# Altium schematic sheet Microphone1.SchDoc: Microphone
size Letter; Author: Ali Saffari; Organization: University of Washinton; Address1: Sensor Systems Lab; Revision: 2; SheetNumber: 1; SheetTotal: 1
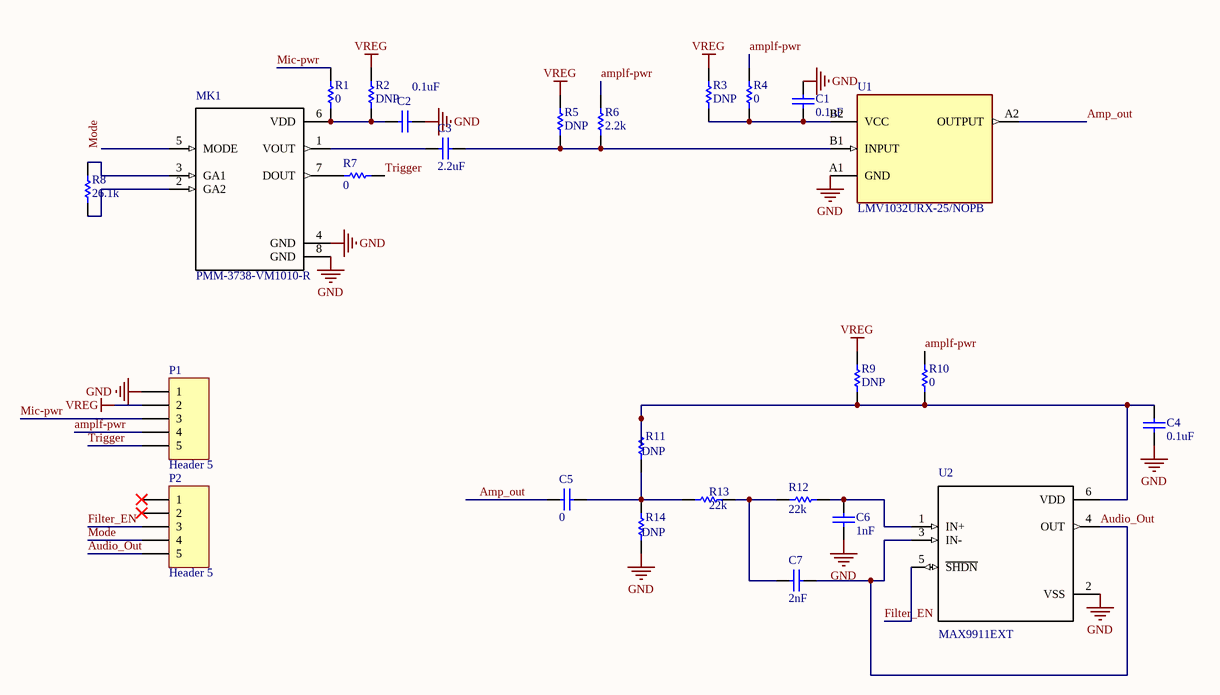
[diagram p0: Microphone1.SchDoc]

## Parts
C1  0.1uF  [0402]
C2  0.1uF  [0402]
C3  2.2uF  [0402]
C4  0.1uF  [0402]
C5  0  [0402]
C6  1nF  [0402]
C7  2nF  [0402]
MK1  PMM-3738-VM1010-R  [MIC_PMM-3738-VM1010-R]
P1  Header 5  [HDR1X5]
P2  Header 5  [HDR1X5]
R1  0  [0402]
R2  value DNP  [0402]  (hidden comment: Res)
R3  DNP  [0402]
R4  0  [0402]
R5  DNP  [0402]
R6  2.2k  [0402]
R7  0  [0402]
R8  26.1k  [0402]
R9  DNP  [0402]
R10  0  [0402]
R11  DNP  [0402]
R12  22k  [0402]
R13  22k  [0402]
R14  DNP  [0402]
U1  LMV1032URX-25/NOPB  [BGA4C2X2X50P_117X117X42]
U2  MAX9911EXT  [MAX9911EXT]

## Nets
GND: C1.2 C2.2 C4.1 C6.2 MK1.4(GND) MK1.8(GND) P1.1 R14.1 U1.A1(GND) U2.2(VSS)
VREG: P1.2 R2.2 R3.1 R5.1 R9.1
Amp_out: C5.1 U1.A2(OUTPUT)
amplf-pwr: P1.4 R4.1 R6.1 R10.1
Audio_Out: C7.1 P2.5 U2.3(IN-) U2.4(OUT)
Filter_EN: P2.3 U2.5(~{SHDN})
Mic-pwr: P1.3 R1.2
Mode: MK1.5(MODE) P2.4
Trigger: P1.5 R7.2
NetC1_1: C1.1 R3.2 R4.2 U1.B2(VCC)
NetC2_1: C2.1 MK1.6(VDD) R1.1 R2.1
NetC3_1: C3.1 MK1.1(VOUT)
NetC3_2: C3.2 R5.2 R6.2 U1.B1(INPUT)
NetC4_2: C4.2 R9.2 R10.2 R11.2 U2.6(VDD)
NetC5_2: C5.2 R11.1 R13.1 R14.2
NetC6_1: C6.1 R12.2 U2.1(IN+)
NetC7_2: C7.2 R12.1 R13.2
NetMK1_2: MK1.2(GA2) R8.2
NetMK1_3: MK1.3(GA1) R8.1
NetMK1_7: MK1.7(DOUT) R7.1

Not connected (* = marked no-connect by the designer): P2 1* 2*

## Notes on the sheet
- Title
- Date:
- Project
- Revision:
- Sheet
- of
- Author:

## Library data of the parts
C1 C2 C4 = Cap: Ceramic Capacitor (Surface Mount); Manufacturer: Murata Electronics North America; Manufacturer Part Number: GCM155R71C104KA55D; Note: CAP CER 0.1UF 16V X7R 0402; Rating: 16V; Digi-Key Part Number: 490-4759-1-ND; Value: 0.1uF
C3 C5 = Cap: Ceramic Capacitor (Surface Mount); Manufacturer: Yageo; Manufacturer Part Number: RC0402JR-070RL; Digi-Key Part Number: 311-0.0JRCT-ND; Note: *; Rating: *
  C3: Value: 2.2uF
  C5: Value: 0
C6 = Cap: Ceramic Capacitor (Surface Mount); Manufacturer: Murata Electronics; Manufacturer Part Number: GCM155R71H102KA37D; Note: CAP CER 1000PF 50V X7R 0402; Rating: 50V; Digi-Key Part Number: 490-4761-1-ND; Value: 1nF
C7 = Cap: Ceramic Capacitor (Surface Mount); Manufacturer: AVX Corporation; Manufacturer Part Number: 04025C202JAT2A; Digi-Key Part Number: 478-10122-1-ND; Note: *; Rating: *; Value: 2nF
MK1 = PMM-3738-VM1010-R: MEMS Microphone Omni-Directional 700 Ohm -38dBV 1.8V Rectangular Solder Pad T/R; Manufacturer Part Number: VM1010; Manufacturer: Vesper Technologies Inc.; Notes: PIEZOELETRIC MEMS MIC SINGLE-END; Digi-Key Part Number: 2022-1001-1-ND
P1 P2 = Header 5: Header, 5-Pin; LatestRevisionDate: 17-Jul-2002; LatestRevisionNote: Re-released for DXP Platform.; Publisher: Altium Limited
R1 R2 = Res: Chip Resistor (Surface Mount); Manufacturer: Generic Chip Res (TBD); Manufacturer Part Number: *; Digi-Key Part Number: *; Rating: *
  R1: Value: 0
R3-R7 R9 R10 = Res: Chip Resistor (Surface Mount); Manufacturer: Yageo; Manufacturer Part Number: RC0402JR-070RL; Digi-Key Part Number: 311-0.0JRCT-ND; Rating: *
  R3 R5 R9: Value: DNP
  R4 R7 R10: Value: 0
  R6: Value: 2.2k
R8 = Res: Chip Resistor (Surface Mount); Manufacturer: Yageo; Manufacturer Part Number: RC0402FR-0726K1L; Digi-Key Part Number: 311-26.1KLRCT-ND; Rating: *; Value: 26.1k
R11 R14 = Res: Chip Resistor (Surface Mount); Manufacturer: Yageo; Manufacturer Part Number: RC0402FR-071ML; Digi-Key Part Number: 311-1.00MLRCT-ND; Rating: *; Value: DNP
R12 R13 = Res: Chip Resistor (Surface Mount); Manufacturer: Yageo; Manufacturer Part Number: RT0402BRD0722KL; Digi-Key Part Number: YAG4210CT-ND; Rating: *; Value: 22k
U1 = LMV1032URX-25/NOPB: Analog input microphone preamplifier for 3-wire electret microphones; MF: Texas Instruments; SnapEDA_Link: https://www.snapeda.com/parts/LMV1032URX-25/NOPB/Texas+Instruments/view-part/?ref=snap; Price: None; Check_prices: https://www.snapeda.com/parts/LMV1032URX-25/NOPB/Texas+Instruments/view-part/?ref=eda; Purchase-URL: https://pricing.snapeda.com/search/part/LMV1032URX-25/NOPB/?ref=eda; Value: *; MP: LMV1032URX-25/NOPB; Package: DSBGA-4 Texas Instruments; Availability: In Stock
U2 = MAX9911EXT: Operational amplifier; 1.8Ã·5.5VDC; Channels: 1; SC70-6; Manufacturer Part Number: MAX9911EXT+T; Manufacturer: Maxim; Common Mode Rejection Ratio: 70dB; Number of Channels: 1; Output Current: 15mA; Slew Rate: 0.1V/µs; Nominal Supply Current: 4uA; Voltage Gain: 120dB; Min Supply Voltage: 1.8V; Max Supply Voltage: 5.5V; Bandwidth: 200kHz; Input Offset Voltage (Vos): 200uV; Input Bias Current: 1pA; Max Frequency: 1kHz; Max Power Dissipation: 245mW; Supplier 1: Digi-Key; Stock 1: 3380; Pricing 1: 1=1, 10=0.893, 25=0.848, 100=0.6511, 250=0.57536, 500=0.54508, 1000=0.51912 (USD); Mount: Surface Mount; Case/Package: SC; Number of Pins: 6; Contact Plating: Gold; Min Operating Temperature: -40°C; Max Operating Temperature: 85°C; Packaging: Tape and Reel; Package Quantity: 2500; Gain Bandwidth Product: 200kHz; Operating Supply Current: 4uA; Number of Circuits: 1; Output Current per Channel: 15mA; Number of Amplifiers: 1; Length: 2.15mm; Height: 1mm; Width: 1.35mm; Radiation Hardening: No; REACH SVHC: No SVHC; Lead Free: Lead Free; ComponentLink1URL: https://datasheets.maximintegrated.com/en/ds/MAX9910-MAX9913.pdf?src-supplier=Digi-Key; ComponentLink1Description: https://datasheets.maximintegrated.com/en/ds/MAX9910-MAX9913.pdf?src-supplier=Digi-Key; ComponentLink2URL: https://media.digikey.com/pdf/Data%20Sheets/Maxim%20PDFs/PartNumberBreakdown_ds.pdf?src-supplier=Digi-Key; ComponentLink2Description: https://media.digikey.com/pdf/Data%20Sheets/Maxim%20PDFs/PartNumberBreakdown_ds.pdf?src-supplier=Digi-Key; ComponentLink3URL: http://datasheets.maxim-ic.com/en/ds/MAX9910-MAX9913.pdf?src-supplier=Avnet+Europe; ComponentLink3Description: http://datasheets.maxim-ic.com/en/ds/MAX9910-MAX9913.pdf?src-supplier=Avnet+Europe; Supplier Part Number 1: MAX9911EXT+TCT-ND